# Altium schematic sheet Microcontroller.SchDoc
size A; DocumentNumber: 2; SheetNumber: 2; SheetTotal: 5
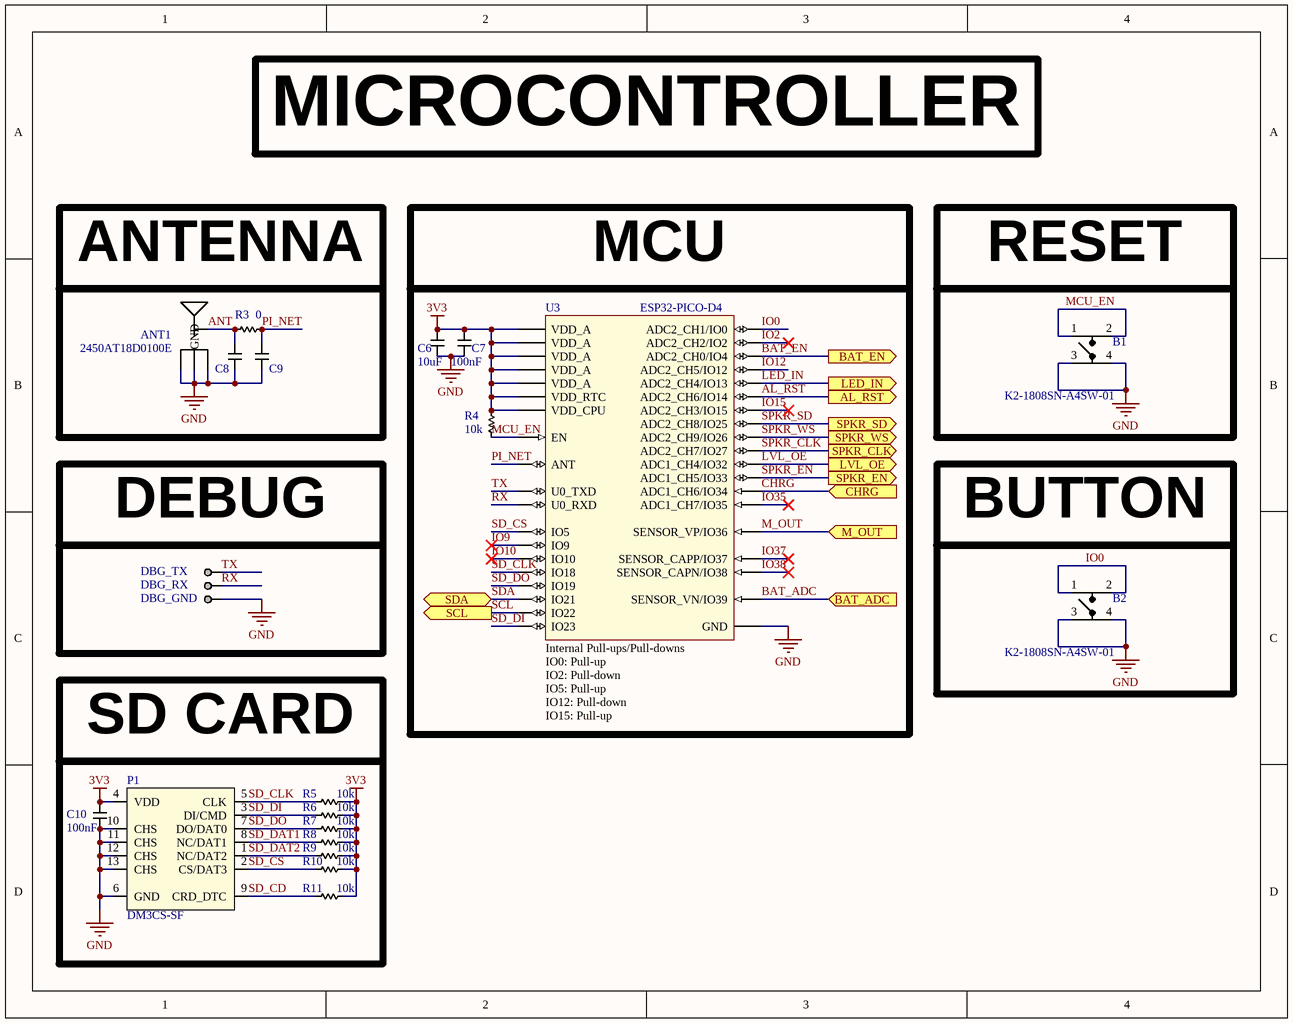
[diagram p0: Microcontroller.SchDoc]

## Parts
ANT1  2450AT18D0100E  [2450AT18D0100E_RH]
B1  K2-1808SN-A4SW-01  [K2-1808SN-A4SW-01]
B2  K2-1808SN-A4SW-01  [K2-1808SN-A4SW-01]
C6  10uF  [CAP_0603_HIGH]
C7  100nF  [CAP_0402_HIGH]
C8  C  [CAP_0402_HIGH]  (value not drawn)  (no BOM)
C9  C  [CAP_0402_HIGH]  (value not drawn)  (no BOM)
C10  100nF  [CAP_0402_HIGH]
DBG_GND  0.1" Header  [0.1" Header]  (value not drawn)  (no BOM)
DBG_RX  0.1" Header  [0.1" Header]  (value not drawn)  (no BOM)
DBG_TX  0.1" Header  [0.1" Header]  (value not drawn)  (no BOM)
P1  DM3CS-SF  [DM3CS-SF]
R3  0  [RES_0402_HIGH]
R4  10k  [RES_0402_HIGH]
R5  10k  [RES_0402_HIGH]
R6  10k  [RES_0402_HIGH]
R7  10k  [RES_0402_HIGH]
R8  10k  [RES_0402_HIGH]
R9  10k  [RES_0402_HIGH]
R10  10k  [RES_0402_HIGH]
R11  10k  [RES_0402_HIGH]
U3  ESP32-PICO-D4  [ESP32-PICO-D4]

## Ports
AL_RST (out), BAT_ADC (in), BAT_EN (out), CHRG (in), LED_IN (out), LVL_OE (out), M_OUT (in), SCL (out), SDA, SPKR_CLK (out), SPKR_EN (out), SPKR_SD (out), SPKR_WS (out)

## Nets
3V3: C6.2 C7.2 C10.2 P1.4(VDD) R4.2 R5.1 R6.1 R7.1 R8.1 R9.1 R10.1 R11.1 U3.1(VDD_A) U3.3(VDD_A) U3.4(VDD_A) U3.19(VDD_RTC) U3.37(VDD_CPU) U3.43(VDD_A) U3.46(VDD_A)
GND: ANT1.2(GND) ANT1.3(GND) ANT1.4(GND) B1.3 B1.4 B2.3 B2.4 C6.1 C7.1 C8.1 C9.1 C10.1 DBG_GND.1 P1.6(GND) P1.10(CHS) P1.11(CHS) P1.12(CHS) P1.13(CHS) U3.49(GND)
AL_RST: U3.17(ADC2_CH6/IO14) ; port AL_RST
ANT: ANT1.1(FEED) C8.2 R3.1
BAT_ADC: U3.8(SENSOR_VN/IO39) ; port BAT_ADC
BAT_EN: U3.24(ADC2_CH0/IO4) ; port BAT_EN
CHRG: U3.10(ADC1_CH6/IO34) ; port CHRG
IO0: B2.1 B2.2 U3.23(ADC2_CH1/IO0)
IO2: U3.22(ADC2_CH2/IO2)
IO9: U3.28(IO9)
IO10: U3.29(IO10)
IO12: U3.18(ADC2_CH5/IO12)
IO15: U3.21(ADC2_CH3/IO15)
IO35: U3.11(ADC1_CH7/IO35)
IO37: U3.6(SENSOR_CAPP/IO37)
IO38: U3.7(SENSOR_CAPN/IO38)
LED_IN: U3.20(ADC2_CH4/IO13) ; port LED_IN
LVL_OE: U3.12(ADC1_CH4/IO32) ; port LVL_OE
M_OUT: U3.5(SENSOR_VP/IO36) ; port M_OUT
MCU_EN: B1.1 B1.2 R4.1 U3.9(EN)
PI_NET: C9.2 R3.2 U3.2(ANT)
RX: DBG_RX.1 U3.40(U0_RXD)
SCL: U3.39(IO22) ; port SCL
SD_CD: P1.9(CRD_DTC) R11.2
SD_CLK: P1.5(CLK) R5.2 U3.35(IO18)
SD_CS: P1.2(CS/DAT3) R10.2 U3.34(IO5)
SD_DAT1: P1.8(NC/DAT1) R8.2
SD_DAT2: P1.1(NC/DAT2) R9.2
SD_DI: P1.3(DI/CMD) R6.2 U3.36(IO23)
SD_DO: P1.7(DO/DAT0) R7.2 U3.38(IO19)
SDA: U3.42(IO21) ; port SDA
SPKR_CLK: U3.16(ADC2_CH7/IO27) ; port SPKR_CLK
SPKR_EN: U3.13(ADC1_CH5/IO33) ; port SPKR_EN
SPKR_SD: U3.14(ADC2_CH8/IO25) ; port SPKR_SD
SPKR_WS: U3.15(ADC2_CH9/IO26) ; port SPKR_WS
TX: DBG_TX.1 U3.41(U0_TXD)

## Notes on the sheet
- MICROCONTROLLER
- ANTENNA
- MCU
- (near B1) RESET
- DEBUG
- (near B2) BUTTON
- SD CARD
- (in symbol ESP32-PICO-D4) Internal Pull-ups/Pull-downs / IO0: Pull-up / IO2: Pull-down / IO5: Pull-up / IO12: Pull-down / IO15: Pull-up /

## Library data of the parts
ANT1 = 2450AT18D0100E_RH: 2450AT18D0100E 2.4GHz  Chip RF Antenna 2.4GHz ~ 2.5GHz 1.5dBi Solder Surface Mount
B1 B2 = K2-1808SN-A4SW-01: K2-1808SN-A4SW-01 Tactile Switch SPST-NO Top Actuated Surface Mount
C6 = Capacitor_0603: 0603 Capacitor
C7-C10 = Capacitor_0402: 0402 Capacitor
P1 = DM3CS-SF: DM3CS-SF 10 (8 + 2) Position Card Connector Secure Digital - microSD™ Surface Mount, Right Angle Gold
R3-R11 = Resistor_0402: 0402 Resistor
U3 = ESP32-PICO-D4: ESP32-PICO-D4 SoC